# EAGLE schematic full_bridge_driver (EAGLE 7.2.0)
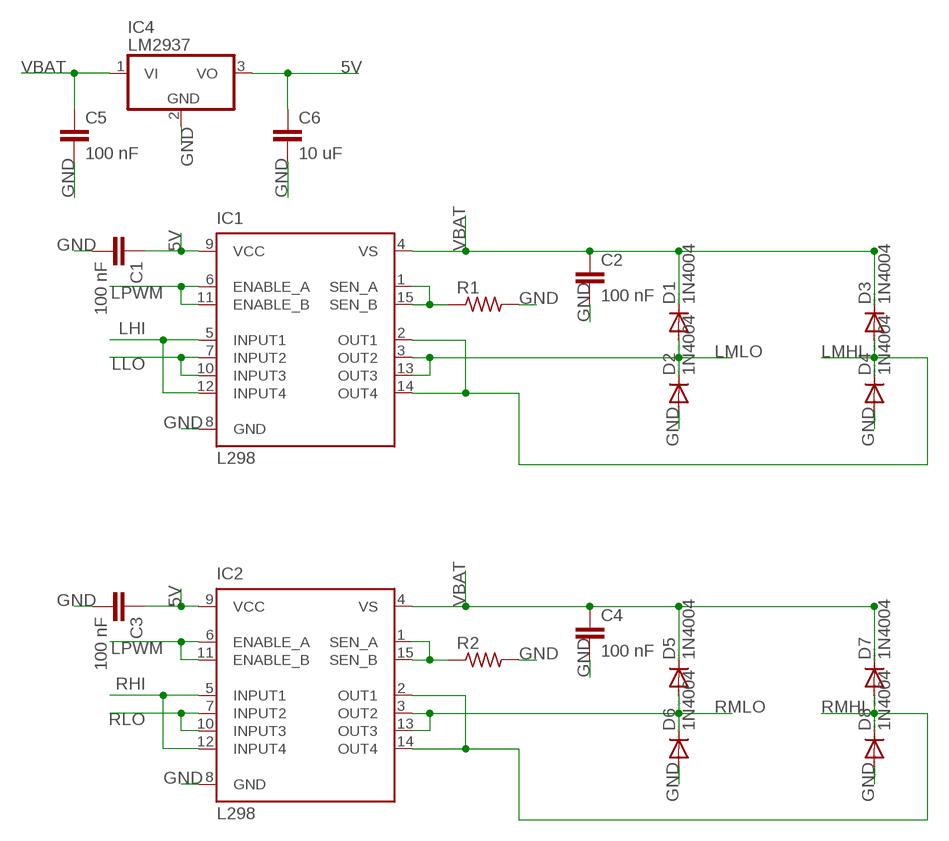
[diagram p0: schematic, sheet 1]

## Parts
C1  100 nF  C-EUC0603  [C0603]
C2  100 nF  C-EUC0603  [C0603]
C3  100 nF  C-EUC0603  [C0603]
C4  100 nF  C-EUC0603  [C0603]
C5  100 nF  C-EUC0603  [C0603]
C6  10 uF  C-EUC0603  [C0603]
D1  1N4004  [DO41-10]
D2  1N4004  [DO41-10]
D3  1N4004  [DO41-10]
D4  1N4004  [DO41-10]
D5  1N4004  [DO41-10]
D6  1N4004  [DO41-10]
D7  1N4004  [DO41-10]
D8  1N4004  [DO41-10]
IC1  L298  [MULTIWATT-15]
IC2  L298  [MULTIWATT-15]
IC4  LM2937  [TO263-3]
R1  R-US_0204/7  [0204/7]
R2  R-US_0204/7  [0204/7]

## Nets
5V: C1.1 C3.1 C6.1 IC1.9(VCC) IC2.9(VCC) IC4.3(VO)
GND: C1.2 C2.2 C3.2 C4.2 C5.2 C6.2 D2.A D4.A D6.A D8.A IC1.8(GND) IC2.8(GND) IC4.2(GND) R1.2 R2.2
LHI: IC1.5(INPUT1) IC1.12(INPUT4)
LLO: IC1.7(INPUT2) IC1.10(INPUT3)
LMHI: D3.A D4.C IC1.2(OUT1) IC1.14(OUT4)
LMLO: D1.A D2.C IC1.3(OUT2) IC1.13(OUT3)
LPWM: IC1.6(ENABLE_A) IC1.11(ENABLE_B) IC2.6(ENABLE_A) IC2.11(ENABLE_B)
N$1: IC2.1(SEN_A) IC2.15(SEN_B) R2.1
N$4: IC1.1(SEN_A) IC1.15(SEN_B) R1.1
RHI: IC2.5(INPUT1) IC2.12(INPUT4)
RLO: IC2.7(INPUT2) IC2.10(INPUT3)
RMHI: D7.A D8.C IC2.2(OUT1) IC2.14(OUT4)
RMLO: D5.A D6.C IC2.3(OUT2) IC2.13(OUT3)
VBAT: C2.1 C4.1 C5.1 D1.C D3.C D5.C D7.C IC1.4(VS) IC2.4(VS) IC4.1(VI)

## Library data of the parts
C1-C6 = rcl:C-EU: CAPACITOR, European symbol
D1-D8 = diode:1N4004: DIODE general purpose rectifier, 1 A
IC1 IC2 = st-microelectronics:L298: DUAL FULL-BRIDGE DRIVER; MPN: L298N; OC_FARNELL: 1589425; OC_NEWARK: 32M1527
IC4 = linear:LM2937: LM2937-2.5, LM2937-3.3 400mA and 500mA Voltage Regulators Source: http://cache.national.com/ds/LM/LM2937-2.5.pdf
R1 R2 = resistor:R-US_: RESISTOR, American symbol